# Altium schematic sheet Sheet1.SchDoc
size A3
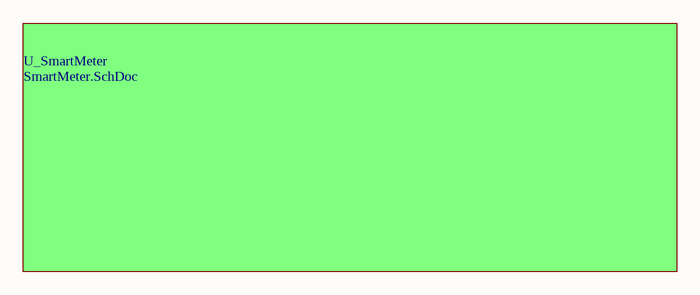
[diagram p0: Sheet1.SchDoc]

## Sub-sheets
U_SmartMeter = SmartMeter.SchDoc: no entries